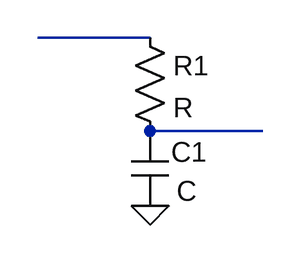
[diagram p0: schematic Draft1.asc]
Draft1.asc, the LTspice schematic file:
Version 4
SHEET 1 880 680
WIRE 160 112 64 112
WIRE 256 192 160 192
FLAG 160 256 0
SYMBOL res 144 96 R0
SYMATTR InstName R1
SYMBOL cap 144 192 R0
WINDOW 0 34 18 Left 0
WINDOW 3 39 51 Left 0
SYMATTR InstName C1

The netlist it stands for:
* Draft1.asc
R1 N001 N002 R
C1 N002 0 C
.backanno
.end